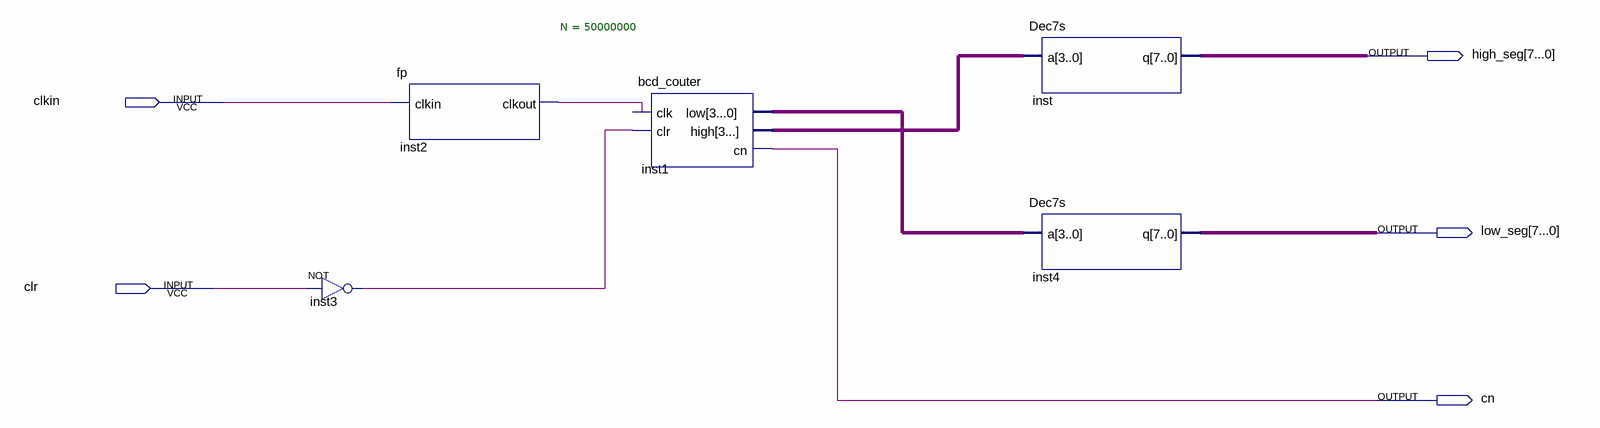
[diagram p0: schematic sheet]
// Quartus schematic Block2.bdf as structural Verilog: 5 symbols, 5 pins
module Block2 (
  input  clkin,
  input  clr,
  output \high_seg[7...0] ,
  output \low_seg[7...0] ,
  output cn
);

  wire inst2_clkout, inst3_out;
  wire [3:0] inst1_high_3____, inst1_low_3___0_;
  wire [7:0] inst4_q, inst_q;

  not inst3 (inst3_out, clr);
  fp #(.N(50000000)) inst2 (.clkin(clkin), .clkout(inst2_clkout));
  bcd_couter inst1 (
    .clr(inst3_out), .\low[3...0] (inst1_low_3___0_), .\high[3...] (inst1_high_3____), .cn(cn));  // open: clk
  Dec7s inst (.a(inst1_high_3____), .q(inst_q));
  Dec7s inst4 (.a(inst1_low_3___0_), .q(inst4_q));
endmodule
